# Altium schematic sheet Clock_Reset_INT_Timer.SchDoc
size A4
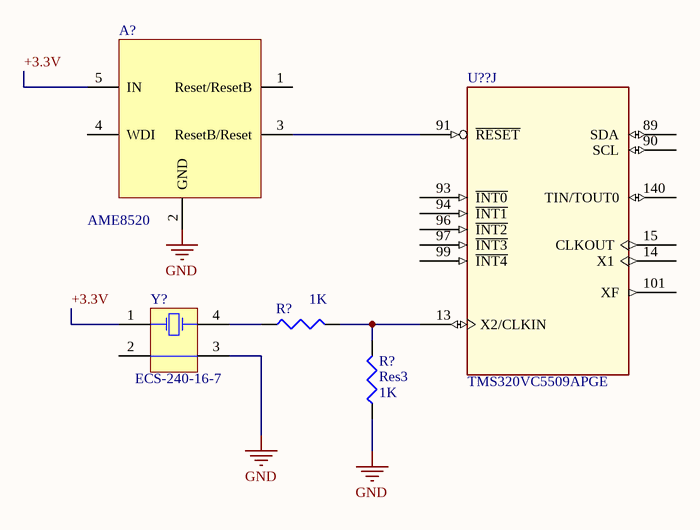
[diagram p0: Clock_Reset_INT_Timer.SchDoc]

## Parts
(Parts that share a designator on the sheet are numbered #1, #2 ... from top to bottom, then left to right.)
A?  AME8520  [SOT23-5AL]
R?#1  value 1K  [3225[1210]]  (hidden comment: Res3)
R?#2  Res3  value 1K  [3225[1210]]
U??  TMS320VC5509APGE  [TMSVC5509APGA]  (part J of 16)
Y?  ECS-240-16-7  [ECX-3M]

## Nets
GND: A?.2(GND) R?#2.1 Y?.3(COM)
+3.3V: A?.5(IN) Y?.1(OSC1)
NetA?_3: A?.3(ResetB/Reset) U??.91(~{RESET})
NetR?#1_1: R?#1.1 Y?.4(OSC2)
NetR?#1_2: R?#1.2 R?#2.2 U??.13(X2/CLKIN)

Not connected (* = marked no-connect by the designer): A? 1(Reset/ResetB) 4(WDI); U?? 14(X1) 15(CLKOUT) 89(SDA) 90(SCL) 93(~{INT0}) 94(~{INT1}) 96(~{INT2}) 97(~{INT3}) 99(~{INT4}) 101(XF) 140(TIN/TOUT0); Y? 2(COM)

## Library data of the parts
A? = AME8520: Watchdog timer
R?#1 R?#2 = Res3: Resistor; Published: 8-Jun-2000; LatestRevisionDate: 04-Mar-2005; LatestRevisionNote: PCB Footprint replaced.; PackageReference: J1-0603; Publisher: Altium Limited
Y? = ECS-240-16-7: Crystal Oscillator; Published: 17-Jul-2002; DatasheetDocument: 18-Apr-2000; PackageReference: ECX-3A; Publisher: Altium Limited; ComponentLink1Description: Manufacturer Link; ComponentLink1URL: http://www.ecsxtal.com/